# Altium schematic sheet 7_Airframe-Sensors.SchDoc
size A4; SheetNumber: 7; SheetTotal: 9
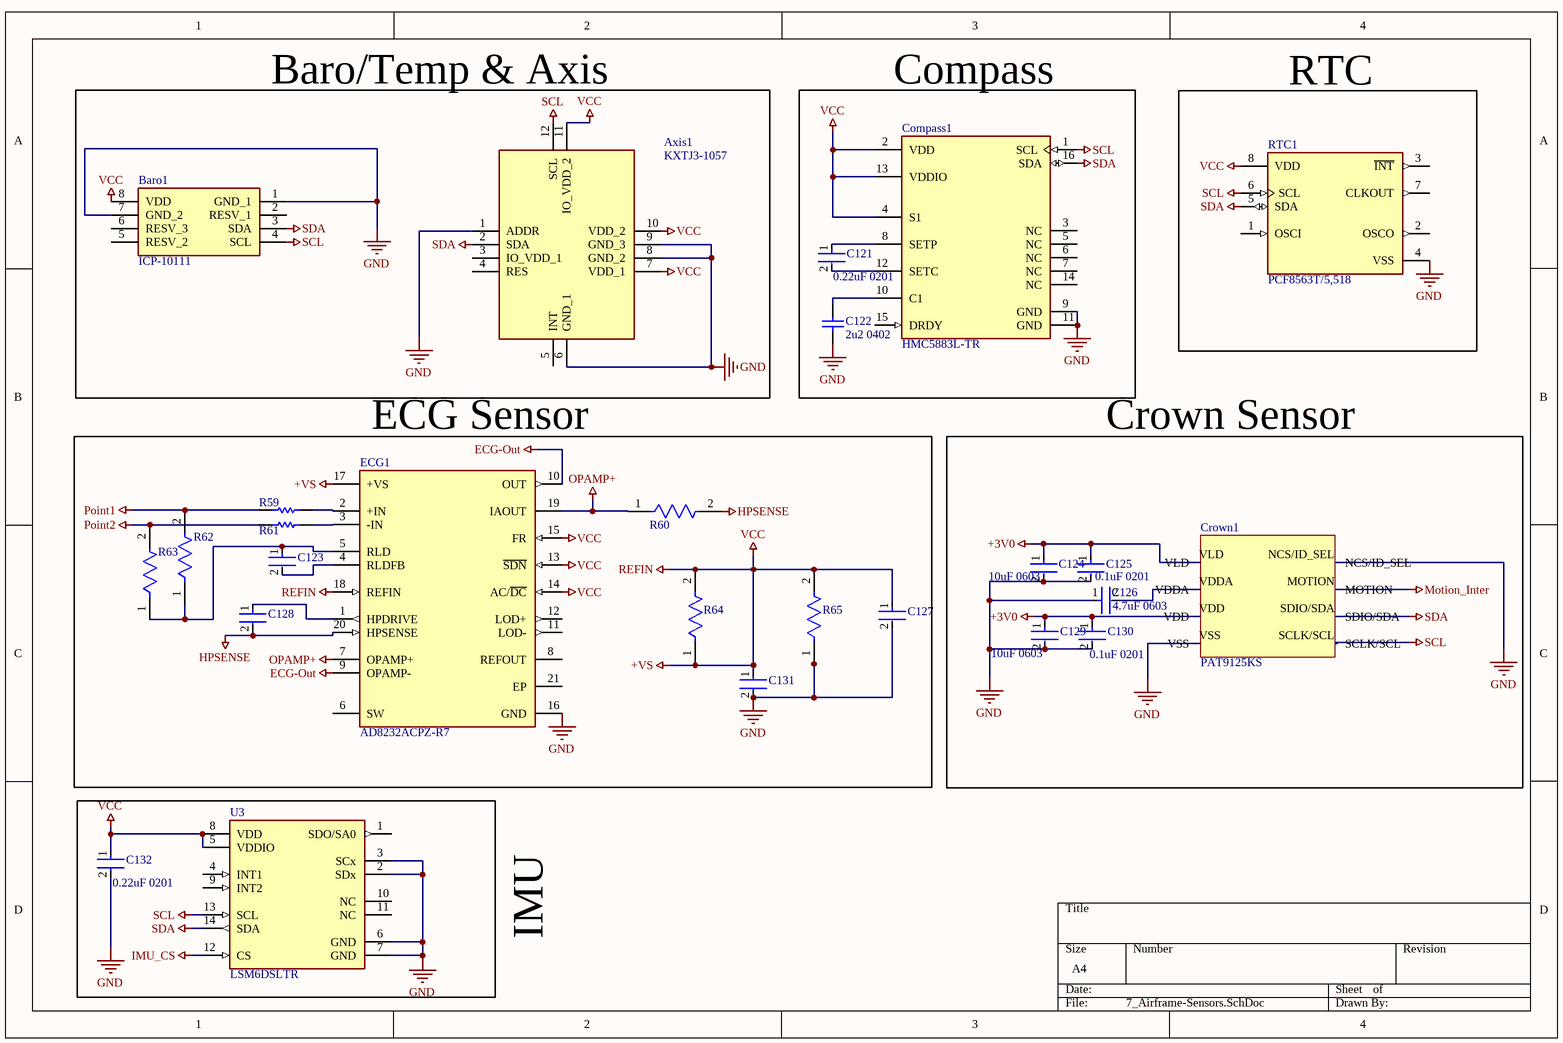
[diagram p0: 7_Airframe-Sensors.SchDoc]

## Parts
Axis1  KXTJ3-1057  [2X2X0.9MMLGA]
Baro1  ICP-10111  [ICP10111]
C121  0.22uF 0201  [FP-C0603-030-0_03-IPC_C]
C122  2u2 0402  [CAPC1005X55X25ML5T10]
C123  GRM1555C1H102JA01D  [FP-GRM155-0_05-IPC_B]  (value not drawn)
C124  10uF 0603  [FP-GRM188-0_2-IPC_C]
C125  0.1uF 0201  [FP-C0603-030-0_03-IPC_C]
C126  4.7uF 0603  [FP-GRM188-0_2-IPC_C]
C127  C0402C104K8PACTU  [FP-C0402-BB-MFG]  (value not drawn)
C128  GRM155R71C224KA12D  [FP-GRM155-0_05-IPC_C]  (value not drawn)
C129  10uF 0603  [FP-GRM188-0_2-IPC_C]
C130  0.1uF 0201  [FP-C0603-030-0_03-IPC_C]
C131  C0402C104K8PACTU  [FP-C0402-BB-MFG]  (value not drawn)
C132  0.22uF 0201  [FP-C0603-030-0_03-IPC_C]
Compass1  HMC5883L-TR  [FP-HMC5883L-TR-MFG]
Crown1  PAT9125KS  [PAT9125KS-Footprint-1]
ECG1  AD8232ACPZ-R7  [FP-CP-20-8-IPC_C]
R59  RC0402FR-07180KL  [RESC1005X40X25ML05T10]  (value not drawn)
R60  CR0402-JW-105GLF  [FP-CR0402-MFG]  (value not drawn)
R61  RC0402FR-07180KL  [RESC1005X40X25ML05T10]  (value not drawn)
R62  CR0402-JW-105GLF  [FP-CR0402-MFG]  (value not drawn)
R63  CR0402-JW-105GLF  [FP-CR0402-MFG]  (value not drawn)
R64  CR0402-JW-105GLF  [FP-CR0402-MFG]  (value not drawn)
R65  CR0402-JW-105GLF  [FP-CR0402-MFG]  (value not drawn)
RTC1  PCF8563T/5,518  [FP-SOT96-1-MFG]
U3  LSM6DSLTR  [FP-LGA-14L-DM00249496-MFG]

## Nets
+3V0: C124.1 C125.1 C129.1 C130.1 Crown1.VDD Crown1.VLD
+VS: Axis1.7(VDD_1) Axis1.10(VDD_2) Axis1.11(IO_VDD_2) Baro1.8(VDD) C127.1 C131.1 C132.1 Compass1.2(VDD) Compass1.4(S1) Compass1.13(VDDIO) ECG1.13(~{SDN}) ECG1.14(AC/~{DC}) ECG1.15(FR) ECG1.17(+VS) ECG1.18(REFIN) R64.1 R64.2 R65.2 RTC1.8(VDD) U3.5(VDDIO) U3.8(VDD)  [also labelled REFIN, VCC]
ECG-Out: ECG1.9(OPAMP-) ECG1.10(OUT)
GND: Axis1.1(ADDR) Axis1.6(GND_1) Axis1.8(GND_2) Axis1.9(GND_3) Baro1.1(GND_1) Baro1.7(GND_2) C122.2 C124.2 C125.2 C126.1 C127.2 C129.2 C130.2 C131.2 C132.2 Compass1.9(GND) Compass1.11(GND) Crown1.NCS/ID_SEL Crown1.VSS ECG1.16(GND) R65.1 RTC1.4(VSS) U3.2(SDx) U3.3(SCx) U3.6(GND) U3.7(GND)
HPSENSE: C128.2 ECG1.20(HPSENSE) R60.2
IMU_CS: U3.12(CS)
Motion_Inter: Crown1.MOTION
OPAMP+: ECG1.7(OPAMP+) ECG1.19(IAOUT) R60.1
Point1: R59.1 R62.2
Point2: R61.1 R63.2
SCL: Axis1.12(SCL) Baro1.4(SCL) Compass1.1(SCL) Crown1.SCLK/SCL RTC1.6(SCL) U3.13(SCL)
SDA: Axis1.2(SDA) Baro1.3(SDA) Compass1.16(SDA) Crown1.SDIO/SDA RTC1.5(SDA) U3.14(SDA)
NetC121_1: C121.1 Compass1.8(SETP)
NetC121_2: C121.2 Compass1.12(SETC)
NetC122_1: C122.1 Compass1.10(C1)
NetC123_1: C123.1 ECG1.5(RLD) R62.1 R63.1
NetC123_2: C123.2 ECG1.4(RLDFB)
NetC126_2: C126.2 Crown1.VDDA
NetC128_1: C128.1 ECG1.1(HPDRIVE)
NetECG1_2: ECG1.2(+IN) R59.2
NetECG1_3: ECG1.3(-IN) R61.2

Not connected (* = marked no-connect by the designer): Axis1 3(IO_VDD_1) 4(RES) 5(INT); Baro1 2(RESV_1) 5(RESV_2) 6(RESV_3); Compass1 3(NC) 5(NC) 6(NC) 7(NC) 14(NC) 15(DRDY); ECG1 6(SW) 8(REFOUT) 11(LOD-) 12(LOD+) 21(EP); RTC1 1(OSCI) 2(OSCO) 3(~{INT}) 7(CLKOUT); U3 1(SDO/SA0) 4(INT1) 9(INT2) 10(NC) 11(NC)

## Notes on the sheet
- Baro/Temp & Axis
- Compass
- RTC
- ECG Sensor
- Crown Sensor
- IMU

## Library data of the parts
Axis1 = KXTJ3-1057: Accelerometer; Manufacturer_Name: Kionix; Datasheet Link: http://www.mouser.com/ds/2/348/KXTJ3-1057 Specifications Rev 2.0-1074602.pdf; Manufacturer_Part_Number: KXTJ3-1057; Mouser Part Number: 912-KXTJ3-1057; Mouser Price/Stock: https://www.mouser.co.uk/ProductDetail/Kionix/KXTJ3-1057?qs=hicmRmzGcNR8WipH%252BLEjqg%3D%3D
Baro1 = ICP-10111: Undefined or Miscellaneous; Manufacturer_Name: TDK; Datasheet Link: https://product.tdk.com/system/files/dam/doc/product/sensor/pressure/capacitive-pressure/data_sheet/ds-000186-icp-101xx.pdf; Height: 1mm; Manufacturer_Part_Number: ICP-10111; Mouser Part Number: 410-ICP-10111; Mouser Price/Stock: https://www.mouser.co.uk/ProductDetail/TDK-InvenSense/ICP-10111?qs=%252BEew9%252B0nqrBWGDChI3rokg%3D%3D; Arrow Part Number: ICP-10111; Arrow Price/Stock: https://www.arrow.com/en/products/icp-10111/invensense
C121 C125 C130 C132 = CMP-08246-007095-1: Multilayer Ceramic Capacitors 220nF ±10% 6.3V X6S SMD 0201; Dielectric: X6S; Resistor Type: Ceramic; Length: 0.6mm; Capacitance: 220nF; Case Code (Metric): 0603; Series: C; Width: 0.012inch; Height: 0.3mm; Voltage Rating: 6.3V; Max Operating Temperature: 105°C; REACH SVHC: No SVHC; RoHS Compliant: Yes; Tolerance: 10%; Termination: SMD/SMT; Case/Package: 0201; Case Code (Imperial): 0201; Weight: 6E-06oz; Lead Free: Lead Free; Construction: Flat; Thickness: 300um; Mount: Surface Mount; Dielectric Material: Ceramic; Voltage Rating (DC): 6.3V; Packaging: Cut Tape; Package Quantity: 1; Min Operating Temperature: -55°C; Depth: 0.3mm
C122 = CMP-1662-00017-1: Chip Capacitor, 1 nF, +/- 10%, 50 V, -55 to 125 degC, 0402 (1005 Metric), RoHS, Tape and Reel; Case\/Package: 0402; Type (Capacitors): X7R; Voltage Rating (DC): 50 V; Capacitance: 1 nF; Width: 0.5 mm; Pins: 2; REACH SVHC: No SVHC; Length: 1 mm; Height: 0.5 mm; PackageDescription: 2-Pin Surface Mount Device, Body 1 x 0.5 mm; DatasheetVersion: 07/2016; Mount: Surface Mount; ComponentLink2Description: Datasheet; Tolerance: 10%; ComponentLink2URL: http://psearch.en.murata.com/capacitor/product/GRM155R71H102KA01%23.pdf; ComponentLink1URL: http://www.murata.com/; Case Code (Metric): 1005; Package Quantity: 10000; Min Operating Temperature: -55 degC; Max Operating Temperature: 125 degC; Voltage Rating: 50 V; ComponentLink1Description: Manufacturer URL; Packaging: Tape and Reel; Radiation Hardening: No; RoHSCompliant: true; PackageReference: 0402; Mounting Technology: Surface Mount; Case Code (Imperial): 0402
C123 = CMP-2008-04254-2: Chip Multilayer Ceramic Capacitors for General Purpose, 0402, 1000pF, C0G, 30ppm/°C, 5%, 50V; Insulation Resistance: 10GR; Capacitance: 1nF; Packaging: Tape and Reel; Lead Free: Lead Free; Tolerance: 5%; Temperature Coefficient: 30ppm/°C; Thickness: 0.022inch; Termination: SMD/SMT; Max Operating Temperature: 125°C; Height: 0.5mm; Package Quantity: 1; Radiation Hardening: No; Material: Ceramic; Case Code (Metric): 1005; Number of Pins: 2; Voltage Rating: 50V; Mount: Surface Mount; Voltage: 50V; Case/Package: 0402; Min Operating Temperature: -55°C; Dielectric Material: Ceramic; Width: 0.5mm; Depth: 0.5mm; Case Code (Imperial): 0402; REACH SVHC: No SVHC; Dielectric: C0G; Voltage Rating (DC): 50V; Length: 1mm
C124 C126 C129 = CMP-2000-06337-3: Chip Multilayer Ceramic Capacitors for General Purpose, 0603, 22uF, X5R, 15%, 20%, 10V; Tolerance: 20%; Weight: 0.000222oz; Material: Ceramic; Depth: 0.8mm; Length: 1.6mm; Termination: SMD/SMT; Capacitance: 22uF; Packaging: Tape and Reel; Width: 0.8mm; Voltage Rating: 10V; Case Code (Imperial): 0603; Mount: Surface Mount; Voltage Rating (DC): 10V; Case/Package: 0603; Thickness: 0.039inch; REACH SVHC: No SVHC; Dielectric: X5R; Height: 0.8mm; Package Quantity: 4000; Case Code (Metric): 1608; Min Operating Temperature: -55°C; Lead Free: Lead Free; Max Operating Temperature: 85°C
C127 C131 = CMP-2008-02046-2: CAP CER 0.1UF 10V X5R 0402; Manufacturer: Kemet; Material: Ceramic; Capacitance: 0.10 μF; Temperature Coefficient: 15%; Tolerance: 0.1; Value: 0.10 μF; Package: C0402-BB; Temperature: -55°C to +125°C; ComponentLink2Description: Datasheet; Temperature Characteristic: X5R; Device Class L1: Passive Components; Height: 0.55mm; Lead Free: Yes; ComponentLink2URL: https://content.kemet.com/datasheets/KEM_C1002_X7R_SMD.pdf; Device Class L2: Capacitors; Temperature Range Low: -55°C; Temperature Range High: +125°C; RoHS: TRUE; Octopart: https://octopart.com/c0402c104k8pactu-kemet-140039; Automotive: No; Mouser Description: Capacitor 100 nF 10 VDC 0402; Category: Cap; Voltage Rating: 10 V; Digikey Description: CAP CER 0.1UF 10V X5R 0402; Ipc Land Pattern Name: CAPC10050X50; Device Class L3: Ceramic Capacitors; Manufacturer Part Number: C0402C104K8PACTU
C128 = CMP-1034-02089-3: Chip Multilayer Ceramic Capacitors for General Purpose, 0402, 0.22uF, X7R, 15%, 10%, 16V; Capacitance: 220nF; Depth: 0.5mm; Dielectric: X7R; Min Operating Temperature: -55°C; Package Quantity: 1; Termination: SMD/SMT; Mount: Surface Mount; Radiation Hardening: No; Height: 0.5mm; Case Code (Metric): 1005; Packaging: Tape and Reel; Material: Ceramic; Voltage: 16V; Voltage Rating (DC): 16V; REACH SVHC: No SVHC; Voltage Rating: 16V; Length: 1mm; Tolerance: 10%; Thickness: 0.022inch; Case Code (Imperial): 0402; Max Operating Temperature: 125°C; Width: 0.02inch; Lead Free: Lead Free; Case/Package: 0402
Compass1 = CMP-2000-05148-2: SENSOR MR I2C 16LCC; Min Supply Voltage: 2.16V; Operating Supply Current: 100uA; Max Supply Voltage: 3.6V; Operating Supply Voltage: 2.5V; Min Operating Temperature: -30°C; Interface: I2C; Max Operating Temperature: 85°C; Package Quantity: 4000; REACH SVHC: No SVHC; Case/Package: LCC; Packaging: Tape and Reel; Number of Pins: 16; Radiation Hardening: No
Crown1 = CMP-00000-2
ECG1 = CMP-09085-000003-1: IC ECG FRONT END 20LFCSP; Input Offset Voltage (Vos): 3mV; Power Supply Rejection Ratio (PSRR): 90dB; Input Bias Current: 50pA; Nominal Supply Current: 170uA; Min Supply Voltage: 2V; Common Mode Rejection Ratio: 80dB; Max Supply Voltage: 3.5V; Contact Plating: Tin; Operating Supply Current: 170uA; Packaging: Tape and Reel; REACH SVHC: No SVHC; Case/Package: LFCSP EP; Number of Pins: 20; Lead Free: Contains Lead; Min Operating Temperature: -40°C; Package Quantity: 1500; Mount: Surface Mount; Max Operating Temperature: 85°C
R59 R61 = CMP-1011-00763-4: Chip Resistor, 180 KOhm, +/- 1%, 62.5 mW, -55 to 155 degC, 0402 (1005 Metric), RoHS, Tape and Reel; Manufacturer: Basic Passives; Power Rating: 62.5 mW; Voltage Rating: 50 V; Case\/Package: 0402; Length: 1 mm; RoHSCompliant: true; Mounting Technology: Surface Mount; Min Operating Temperature: -55 degC; PackageDescription: 2-Pin Surface Mount Device, Body 1 x 0.5 mm; Case Code (Imperial): 0402; Resistance: 180 KOhm; ComponentLink2URL: http://download.siliconexpert.com/pdfs/2016/1/13/0/45/27/830/yageo_/manual/8727809758379137pyu-rc_group_51_rohs_l___3.pdf; Packaging: Tape and Reel; Tolerance: 1%; Width: 0.5 mm; PackageReference: 0402; PartNumber: RC0402FR-07180KL; Max Operating Temperature: 155 degC; Package Quantity: 200; Height: 0.35 mm; Mount: Surface Mount; Pins: 2; DatasheetVersion: 12/2015; ComponentLink1URL: http://www.yageo.com/; ComponentLink1Description: Manufacturer URL; Case Code (Metric): 1005; REACH SVHC: No SVHC; ComponentLink2Description: Datasheet
R60 R62-R65 = CMP-2002-05525-2: Thick Film Chip Resistors 0402 1MΩ 0.0625W 5% 200ppm/°C; Voltage Rating: 50V; Max Power Dissipation: 63mW; Resistance: 1MR; Power Rating: 62.5mW; Case/Package: 0402; Depth: 0.5mm; Case Code (Imperial): 0402; Width: 0.02inch; Length: 1mm; Tolerance: 5%; Min Operating Temperature: -55°C; Number of Terminations: 2; Thickness: 356um; Case Code (Metric): 1005; Radiation Hardening: No; Height: 0.016inch; Military Standard: Not; Mount: Surface Mount; Termination: SMD/SMT; Composition: Thick Film; Temperature Coefficient: 200ppm/°C; Contact Plating: Tin; Packaging: Tape and Reel; Package Quantity: 10000; Max Operating Temperature: 125°C
RTC1 = CMP-10083-000010-1: IC RTC CLK/CALENDAR I2C 8-SOIC; Manufacturer: NXP; Nominal Supply Current: 0.225-0.95uA; Interface: I2C,2-Wire; Min Supply Voltage: 1V; Frequency: 400kHz; Standoff Height: 0.1mm; Number Of Outputs: 1; Max Supply Voltage: 5.5V; Digikey Description: IC RTC CLK/CALENDAR I2C 8-SOIC; Height: 1.75mm; Temperature: -40°C to +85°C; Category: IC; Package: SOT96-1; Ambient Temperature Range High: +85°C; Octopart: https://octopart.com/pcf8563t%2F5%2C518-nxp+semiconductors-19647995; Footprint Url: https://www.nxp.com/docs/en/package-information/SOT96-1.pdf; ComponentLink2URL: https://www.nxp.com/docs/en/data-sheet/PCF8563.pdf; RoHS: TRUE; ComponentLink2Description: Datasheet; Lead Free: Yes; Temperature Range Low: -40°C; Ambient Temperature Range Low: -40°C; Manufacturer Part Number: PCF8563T/5,518; Device Class L3: Real Time Clocks; Temperature Range High: +85°C; Automotive: No; Device Class L2: Clock and Timing; Mouser Description: Real Time Clock Binary I2C 1-5V RTC IC; Device Class L1: Integrated Circuits (ICs)
U3 = CMP-2000-07467-2: IMU ACCEL/GYRO I2C/SPI 14LGA; Manufacturer: STMicroelectronics; Resolution: 16bits; Max Supply Voltage: 3.6V; Sensor Type: Temperature,Accelerometer,Gyroscope; Sensor Output: I2C,SPI; Gyro Range: 125/250/500/1000/2000°/s; Accel Range: 2/4/8/16g; Operating Supply Current: 0.29-0.65mA; Min Supply Voltage: 1.62V; Package: LGA-14L-DM00249496; Temperature Range High: +85°C; Automotive: No; Footprint Url: https://www.st.com/resource/en/technical_note/cd00134799.pdf; Height: 0.86mm; Device Class L1: Sensors; Octopart: https://octopart.com/lsm6dsltr-stmicroelectronics-66358193; Device Class L2: Motion Sensors; Lead Free: Yes; Category: IC; Device Class L3: Inertial Measurement Units (IMUs); ComponentLink2Description: Datasheet; RoHS: TRUE; ComponentLink2URL: https://www.st.com/resource/en/datasheet/lsm6dsl.pdf; Temperature Range Low: -40°C; Manufacturer Part Number: LSM6DSLTR; Mouser Description: iNEMO inertial module: always-on 3D accelerometer and 3D gyroscope; Digikey Description: IMU ACCEL/GYRO I2C/SPI 14LGA; Temperature: -40°C to +85°C